# Altium schematic sheet Multiple Power Supply_schematic.SchDoc
size 220 x 127 mm; SheetNumber: 1; SheetTotal: 1
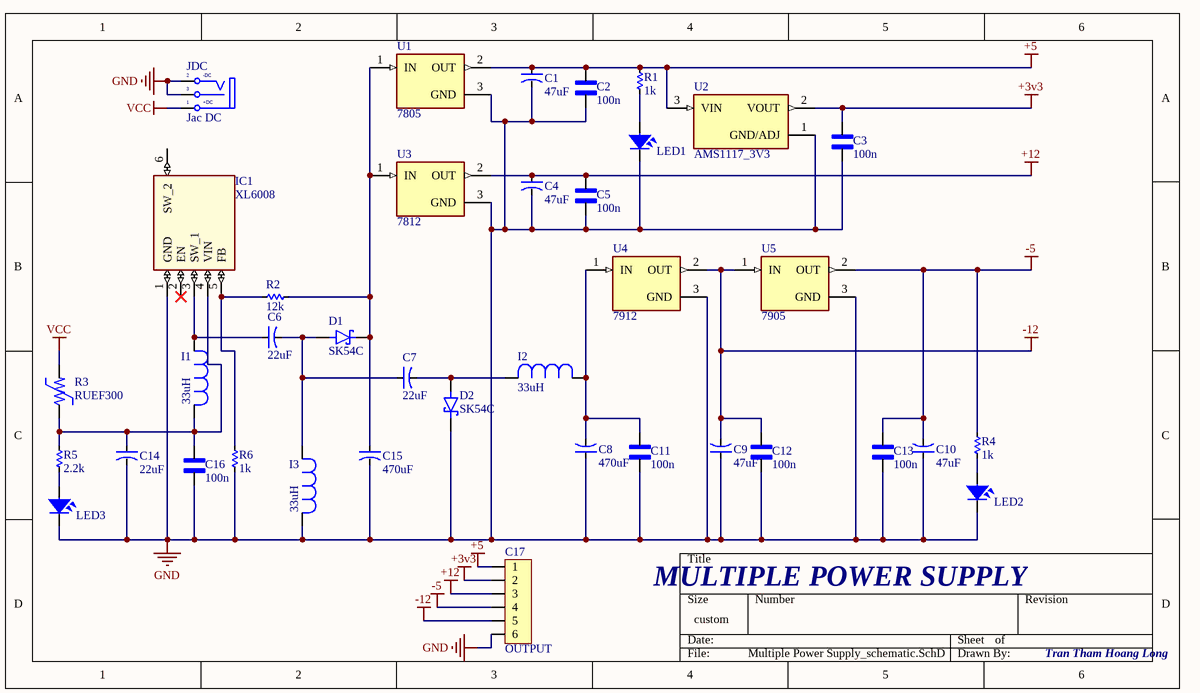
[diagram p0: Multiple Power Supply_schematic.SchDoc]

## Parts
C1  47uF  [CAP-ALU-SMD-D]
C2  100n  [Cap 100nF 50V 1206]
C3  100n  [Cap 100nF 50V 1206]
C4  47uF  [CAP-ALU-SMD-D]
C5  100n  [Cap 100nF 50V 1206]
C6  22uF  [CAP-ALU-SMD-D]
C7  22uF  [CAP-ALU-SMD-D]
C8  470uF  [CAP-ALU-SMD-5x5.5x1.4]
C9  47uF  [CAP-ALU-SMD-D]
C10  47uF  [CAP-ALU-SMD-D]
C11  100n  [Cap 100nF 50V 1206]
C12  100n  [Cap 100nF 50V 1206]
C13  100n  [Cap 100nF 50V 1206]
C14  22uF  [CAP-ALU-SMD-D]
C15  470uF  [CAP-ALU-SMD-5x5.5x1.4]
C16  100n  [Cap 100nF 50V 1206]
C17  OUTPUT  [Header6]
D1  SK54C  [SK54C]
D2  SK54C  [SK54C]
I1  33uH  [Inductor-CDRH127]
I2  33uH  [Inductor-CDRH127]
I3  33uH  [Inductor-CDRH127]
IC1  XL6008  [XL6008]
JDC  Jac DC  [DC0]
LED1  LED  [LED-0805-Red]  (value not drawn)
LED2  LED  [LED-0805-Red]  (value not drawn)
LED3  LED  [LED-0805-Red]  (value not drawn)
R1  1k  [RES-SMD-0805]
R2  12k  [RES-SMD-0805]
R3  RUEF300  [RUEF300]
R4  1k  [RES-SMD-0805]
R5  2.2k  [RES-SMD-0805]
R6  1k  [RES-SMD-0805]
U1  7805  [TO-263]
U2  AMS1117_3V3  [AMS1117_3v3]
U3  7812  [TO-263]
U4  7912  [TO-263]
U5  7905  [TO-263]

## Nets
+3v3: C3.2 C17.2 U2.2(VOUT)
+5: C1.1 C2.2 C17.1 R1.1 U1.2(OUT) U2.3(VIN)
+12: C4.1 C5.2 C17.3 U3.2(OUT)
-5: C10.2 C13.2 C17.4 R4.1 U5.2(OUT)
-12: C9.2 C12.2 C17.5 U4.2(OUT) U5.1(IN)
GND: C1.2 C2.1 C3.1 C4.2 C5.1 C8.1 C9.1 C10.1 C11.1 C12.1 C13.1 C14.2 C15.2 C16.1 C17.6 D2.C(K) I3.1 IC1.1(GND) JDC.2(TN) JDC.3(S) LED1.2 LED2.2 LED3.2 R6.2 U1.3(GND) U2.1(GND/ADJ) U3.3(GND) U4.3(GND) U5.3(GND)
VCC: JDC.1(T) R3.P$2
NetC6_1: C6.1 I1.2 IC1.3(SW_1)
NetC6_2: C6.2 C7.1 D1.A I3.2
NetC7_2: C7.2 D2.A I2.2
NetC8_2: C8.2 C11.2 I2.1 U4.1(IN)
NetC14_1: C14.1 C16.2 I1.1 IC1.4(VIN) R3.P$1 R5.1
NetC15_1: C15.1 D1.C(K) R2.2 U1.1(IN) U3.1(IN)
NetIC1_5: IC1.5(FB) R2.1 R6.1
NetLED1_1: LED1.1 R1.2
NetLED2_1: LED2.1 R4.2
NetLED3_1: LED3.1 R5.2

Not connected (* = marked no-connect by the designer): IC1 2(EN)* 6(SW_2)

## Notes on the sheet
- MULTIPLE POWER SUPPLY
- Tran Tham Hoang Long
- (in symbol DCIN) -DC; +DC

## Library data of the parts
C1 C4 C6-C10 C14 C15 = CN-ALU-SMD: Polarized Capacitor (Axial); Published: 8-Jun-2000; LatestRevisionDate: 17-Jul-2002; LatestRevisionNote: Re-released for DXP Platform.; PackageReference: POLAR0.8; Publisher: Altium Limited
C2 C3 C5 C11-C13 C16 = Cap SMD: Cap Ceramic
C17 = Header6: Header IDC, 6 x 1 Pin Vertical 2.54mm Pitch (Non-Boxed, Male); Manufacturer: W¨¹rth Elektronik eiSos GmbH; partNo: 613002143121; ComponentLink1 Description: Manufacturer; ComponentLink2 Description: Datasheet; NoPins: 02; Created Date: 29 March 2013; ComponentLink1URL: http://www.we-online.com; ComponentLink2URL: http://katalog.we-online.de/em/datasheet/6130xx143121.pdf; Created by: Karrer Zheng
D1 D2 = SK54C: Diode 5A 40V
I1-I3 = Inductor_SMD: CDRH127
IC1 = XL6008: The XL6008 regulator is a wide input range, current mode, DC/DC converter which is capable of generating either positive or negative output voltages.
JDC = DCIN: Jac DC input; Value: Jac DC
LED1-LED3 = LED SMD: Value: LED 3 - 5 ly 2 Colour
R1 R2 R4-R6 = Res-SMD: Resistor; Manufacturer: Generic Components; Class: Passive; Published: 08/06/2000; Publisher: Altium Hobart Technology Centre
R3 = RUEF300: Polymeric PTC Resettable Fuse 30V 3 A Ih Through Hole Radial, Disc
U1 U3-U5 = LM78xx: Linear Voltage Regulator IC Positive Fixed 1 Output 1.5A D2PAK